# Altium schematic sheet ZHSD-JTAG.SchDoc
size A4; DocumentNumber: 5; SheetNumber: 5; SheetTotal: 16; Size: A4
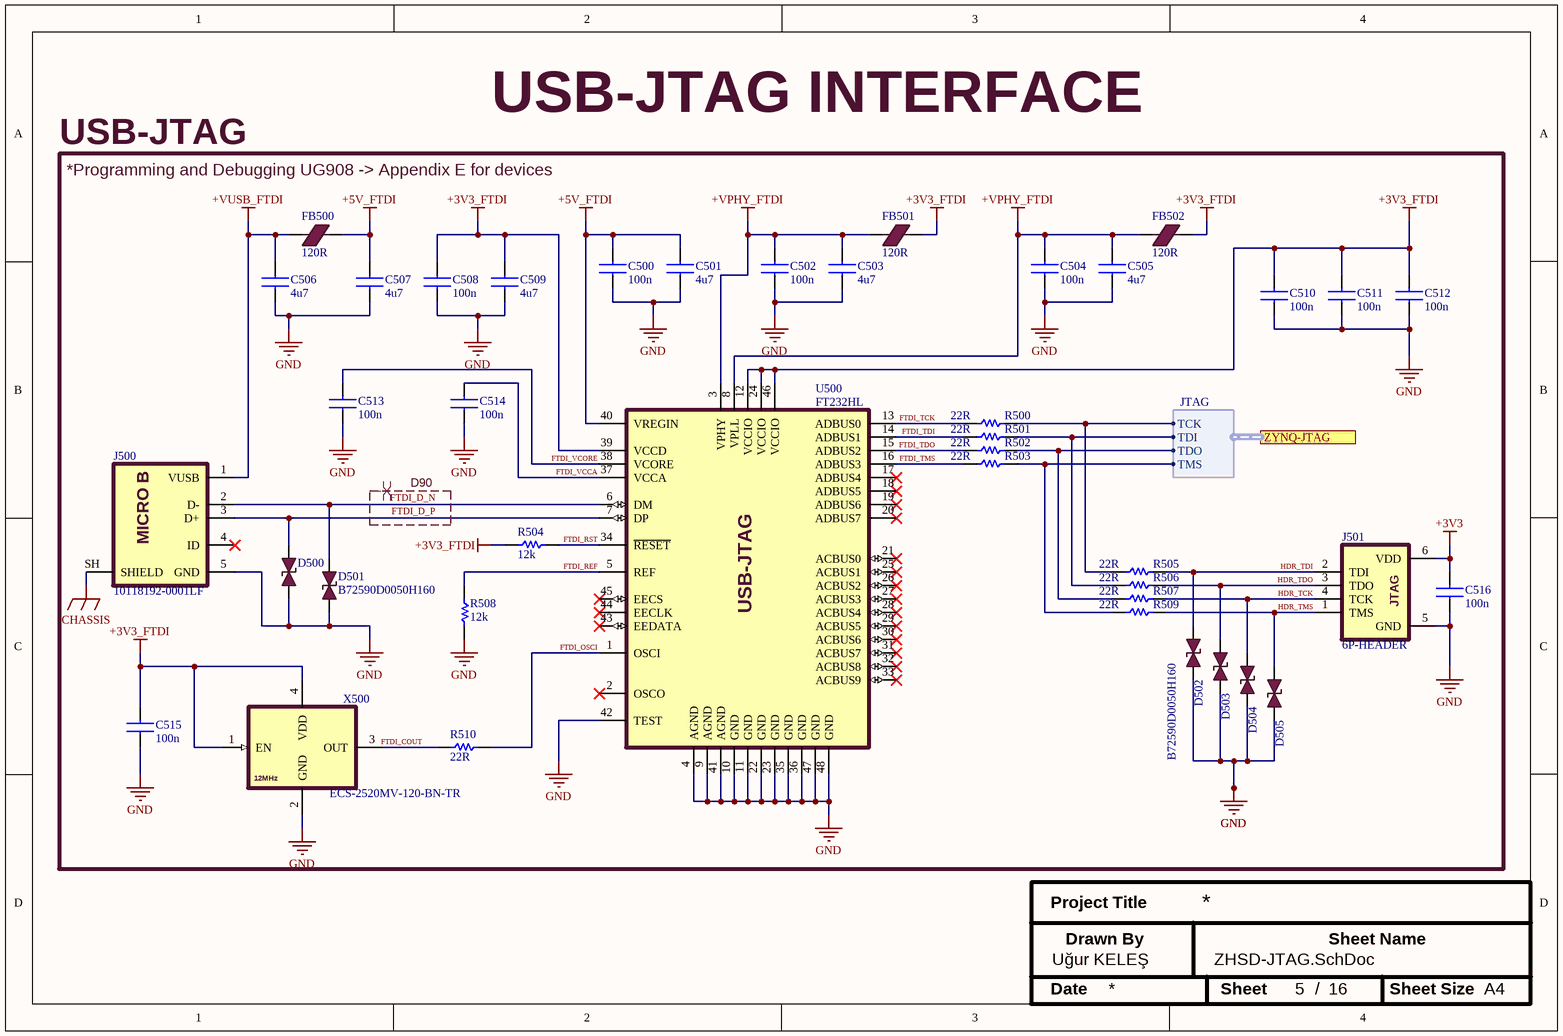
[diagram p0: ZHSD-JTAG.SchDoc]

## Parts
C500  100n  [0603CAPC1608X09N]
C501  4u7  [0603CAPC1608X09N]
C502  100n  [0603CAPC1608X09N]
C503  4u7  [0603CAPC1608X09N]
C504  100n  [0603CAPC1608X09N]
C505  4u7  [0603CAPC1608X09N]
C506  4u7  [0603CAPC1608X09N]
C507  4u7  [0603CAPC1608X09N]
C508  100n  [0603CAPC1608X09N]
C509  4u7  [0603CAPC1608X09N]
C510  100n  [0603CAPC1608X09N]
C511  100n  [0603CAPC1608X09N]
C512  100n  [0603CAPC1608X09N]
C513  100n  [0603CAPC1608X09N]
C514  100n  [0603CAPC1608X09N]
C515  100n  [0603CAPC1608X09N]
C516  100n  [0603CAPC1608X09N]
D500  B72590D0050H160  [0402DIOC1005X06N]  (value not drawn)
D501  B72590D0050H160  [0402DIOC1005X06N]
D502  B72590D0050H160  [0402DIOC1005X06N]  (value not drawn)
D503  B72590D0050H160  [0402DIOC1005X06N]  (value not drawn)
D504  B72590D0050H160  [0402DIOC1005X06N]  (value not drawn)
D505  B72590D0050H160  [0402DIOC1005X06N]
FB500  120R  [0603INDC1608X08N]
FB501  120R  [0603INDC1608X08N]
FB502  120R  [0603INDC1608X08N]
J500  10118192-0001LF  [USB2.0 MICRO B SMD]
J501  6P-HEADER  [CONN-6P-HEADER]
R500  22R  [0603RESC1608X05N]
R501  22R  [0603RESC1608X05N]
R502  22R  [0603RESC1608X05N]
R503  22R  [0603RESC1608X05N]
R504  12k  [0603RESC1608X05N]
R505  22R  [0603RESC1608X05N]
R506  22R  [0603RESC1608X05N]
R507  22R  [0603RESC1608X05N]
R508  12k  [0603RESC1608X05N]
R509  22R  [0603RESC1608X05N]
R510  22R  [0603RESC1608X05N]
U500  FT232HL  [LQFP50P900X900X160-48N]
X500  ECS-2520MV-120-BN-TR  [XTAL_2520]

## Ports
ZYNQ-JTAG (harness JTAG, see ZHSD-Block[3600,5700], ZHSD-ZYNQ-CONFIG[9900,4700])

## Harnesses
JTAG: TCK, TDI, TDO, TMS

## Nets
+3V3: C516.2 J501.6(VDD)
+3V3_FTDI: C508.2 C509.2 C510.2 C511.2 C512.2 C515.2 FB501.2 FB502.2 R504.1 U500.12(VCCIO) U500.24(VCCIO) U500.39(VCCD) U500.46(VCCIO) X500.1(EN) X500.4(VDD)
+5V_FTDI: C500.2 C501.2 C507.2 FB500.2 U500.40(VREGIN)
+VPHY_FTDI: C502.2 C503.2 C504.2 C505.2 FB501.1 FB502.1 U500.3(VPHY) U500.8(VPLL)
+VUSB_FTDI: C506.2 FB500.1 J500.1(VUSB)
CHASSIS: J500.SH(SHIELD)
GND: C500.1 C501.1 C502.1 C503.1 C504.1 C505.1 C506.1 C507.1 C508.1 C509.1 C510.1 C511.1 C512.1 C513.1 C514.1 C515.1 C516.1 D500.1 D501.1 D502.1 D503.1 D504.1 D505.1 J500.5(GND) J501.5(GND) R508.2 U500.4(AGND) U500.9(AGND) U500.10(GND) U500.11(GND) U500.22(GND) U500.23(GND) U500.35(GND) U500.36(GND) U500.41(AGND) U500.42(TEST) U500.47(GND) U500.48(GND) X500.2(GND)
FTDI_COUT: R510.1 X500.3(OUT)
FTDI_D_N: D501.2 J500.2(D-) U500.6(DM)
FTDI_D_P: D500.2 J500.3(D+) U500.7(DP)
FTDI_OSCI: R510.2 U500.1(OSCI)
FTDI_REF: R508.1 U500.5(REF)
FTDI_RST: R504.2 U500.34(~{RESET})
FTDI_TCK: R500.1 U500.13(ADBUS0)
FTDI_TDI: R501.1 U500.14(ADBUS1)
FTDI_TDO: R502.1 U500.15(ADBUS2)
FTDI_TMS: R503.1 U500.16(ADBUS3)
FTDI_VCCA: C514.2 U500.37(VCCA)
FTDI_VCORE: C513.2 U500.38(VCORE)
HDR_TCK: D504.2 J501.4(TCK) R507.2
HDR_TDI: D502.2 J501.2(TDI) R505.2
HDR_TDO: D503.2 J501.3(TDO) R506.2
HDR_TMS: D505.2 J501.1(TMS) R509.2
NetR500_2: R500.2 R505.1 ; port ZYNQ-JTAG.TCK
NetR501_2: R501.2 R506.1 ; port ZYNQ-JTAG.TDI
NetR502_2: R502.2 R507.1 ; port ZYNQ-JTAG.TDO
NetR503_2: R503.2 R509.1 ; port ZYNQ-JTAG.TMS

Not connected (* = marked no-connect by the designer): J500 4(ID)*; U500 2(OSCO)* 17(ADBUS4)* 18(ADBUS5)* 19(ADBUS6)* 20(ADBUS7)* 21(ACBUS0)* 25(ACBUS1)* 26(ACBUS2)* 27(ACBUS3)* 28(ACBUS4)* 29(ACBUS5)* 30(ACBUS6)* 31(ACBUS7)* 32(ACBUS8)* 33(ACBUS9)* 43(EEDATA)* 44(EECLK)* 45(EECS)*

## Layout directives
differential pair; differential pair class USB; rule Differential Pairs Routing [Pref Gap = 6.299mil    Min Gap  = 5mil    Max Gap  = 7.874milPref Width = 3.937mil    Min Width  = 3.937mil    Max Width  = 4.768mil]; Impedance: D90: FTDI_D_N, FTDI_D_P

## Notes on the sheet
- USB-JTAG
- *Programming and Debugging UG908 -> Appendix E for devices
- USB-JTAG INTERFACE
- Project Title
- Uğur KELEŞ
- Drawn By
- Sheet Name
- Date
- Sheet
- /
- Sheet Size
- A4
- (in symbol ECS-2520MV-120-BN-TR) 12MHz
- (in symbol FT232HL) USB-JTAG
- (in symbol JTAG-HEADER) JTAG
- (in symbol USB-MICRO-B) MICRO B

## Library data of the parts
C500 C502 C504 C508 C510-C516 = GRM155R71C104KA88J: CAP CER 0.1UF 16V X7R 0402 (1005) ±10%; Manufacturer: Murata Electronics; Value: 0.1 µF; ComponentLink1Description: Datasheet; ComponentLink1URL: https://search.murata.co.jp/Ceramy/image/img/A01X/G101/ENG/GRM155R71C104KA88-01.pdf; MPN: GRM155R71C104KA88J; Package: 0402; Tolerance: ±10%; Voltage: 16V
C501 C503 C505-C507 C509 = CL10A475KP8NNNC: CAP CER 4.7UF 10V X5R 0603 (1608) ±10%; Manufacturer: Samsung Electro-Mechanics; Value: 4.7 µF; ComponentLink1Description: Datasheet; ComponentLink1URL: https://mm.digikey.com/Volume0/opasdata/d220001/medias/docus/609/CL10A475KP8NNNC_Spec.pdf; MPN: CL10A475KP8NNNC; Package: 0603; Tolerance: ±10%; Voltage: 10V
D500-D505 = B72590D0050H160: Varistor 1 Circuit Surface Mount, MLCV 0402 (1005 Metric); Manufacturer: EPCOS - TDK Electronics; ComponentLink1Description: Datasheet; ComponentLink1URL: https://www.tdk-electronics.tdk.com/inf/75/ds/High_speed_series.pdf?ref_disty=digikey; MPN: B72590D0050H160; Package: 0402
FB500-FB502 = BLM18SG121TN1D: FERRITE BEAD 120 OHM 0603 (1608) 3A 25mOhm; Manufacturer: Murata Electronics; Impedance @ Frequency: 120 Ohms @ 100 MHz; ComponentLink1Description: Datasheet; ComponentLink1URL: https://pim.murata.com/asset/pim4/ferriteBeadInductortypefilter/ENFA0003_PDF_FERRITEBEADINDUCTORTYPEFILTER?lastModifiedDatetime=20250707190934; ComponentLink2Description: Website; ComponentLink2URL: https://pim.murata.com/en-global/pim/details/?partNum=BLM18SG121TN1%23; Current Rating (Max): 3A; DC Resistance (DCR) (Max): 25mOhm; MPN: BLM18SG121TN1D; Package: 0603
J500 = USB-MICRO-B: CONN RCPT USB2.0 MICRO B SMD R/A; Manufacturer: Amphenol ICC (FCI); ComponentLink1Description: Datasheet; ComponentLink1URL: https://cdn.amphenol-cs.com/media/wysiwyg/files/documentation/datasheet/inputoutput/io_usb_micro.pdf; MPN: 10118192-0001LF
J501 = JTAG-HEADER: JTAG CONN HEADER VERT 6POS 2.54MM
R500-R503 R505-R507 R509 R510 = RC0603FR-0722RL: RES 22 OHM 1% 1/10W 0603 (1608); Manufacturer: YAGEO; Value: 22 Ohms; Voltage: 75V; ComponentLink1Description: Datasheet; ComponentLink1URL: https://yageogroup.com/content/datasheet/asset/file/PYU-RC_GROUP_51_ROHS_L; MPN: RC0603FR-0722RL; Tolerance: ±1%; Package: 0603
R504 R508 = RC0603FR-0712KL: RES 12K OHM 1% 1/10W 0603 (1608); Manufacturer: YAGEO; Value: 12 kOhms; Voltage: 75V; ComponentLink1Description: Datasheet; ComponentLink1URL: https://yageogroup.com/content/datasheet/asset/file/PYU-RC_GROUP_51_ROHS_L; MPN: RC0603FR-0712KL; Tolerance: ±1%; Package: 0603
U500 = FT232HL: USB Bridge, USB to UART (JTAG),FIFO USB 2.0 UART, FIFO Interface 48-LQFP (7x7); Manufacturer: FTDI, Future Technology Devices International Ltd; MPN: FT232HL-REEL; ComponentLink1Description: Datasheet; ComponentLink1URL: https://ftdichip.com/wp-content/uploads/2024/09/DS_FT232H.pdf#page=51&zoom=100,72,126
X500 = ECS-2520MV-120-BN-TR: XTAL OSC XO 12.0000MHZ CMOS SMD; Manufacturer: ECS Inc.; ComponentLink1Description: Datasheet; ComponentLink1URL: https://ecsxtal.com/store/pdf/ECS-2520MV.pdf; MPN: ECS-2520MV-120-BN-TR